# EasyEDA Pro project 1752201976896_ProPrj_orp传感器设计_2025-07-01.epro

# Schematic STM32最小系统
Board Name: Board1; Create Date: 2025-07-01; Page Name: P1; Project Name: orp传感器设计; Schematic Name: STM32最小系统; Update Date: 2025-07-01; Company: 嘉立创EDA; Page Size: A4; Version: V1.0
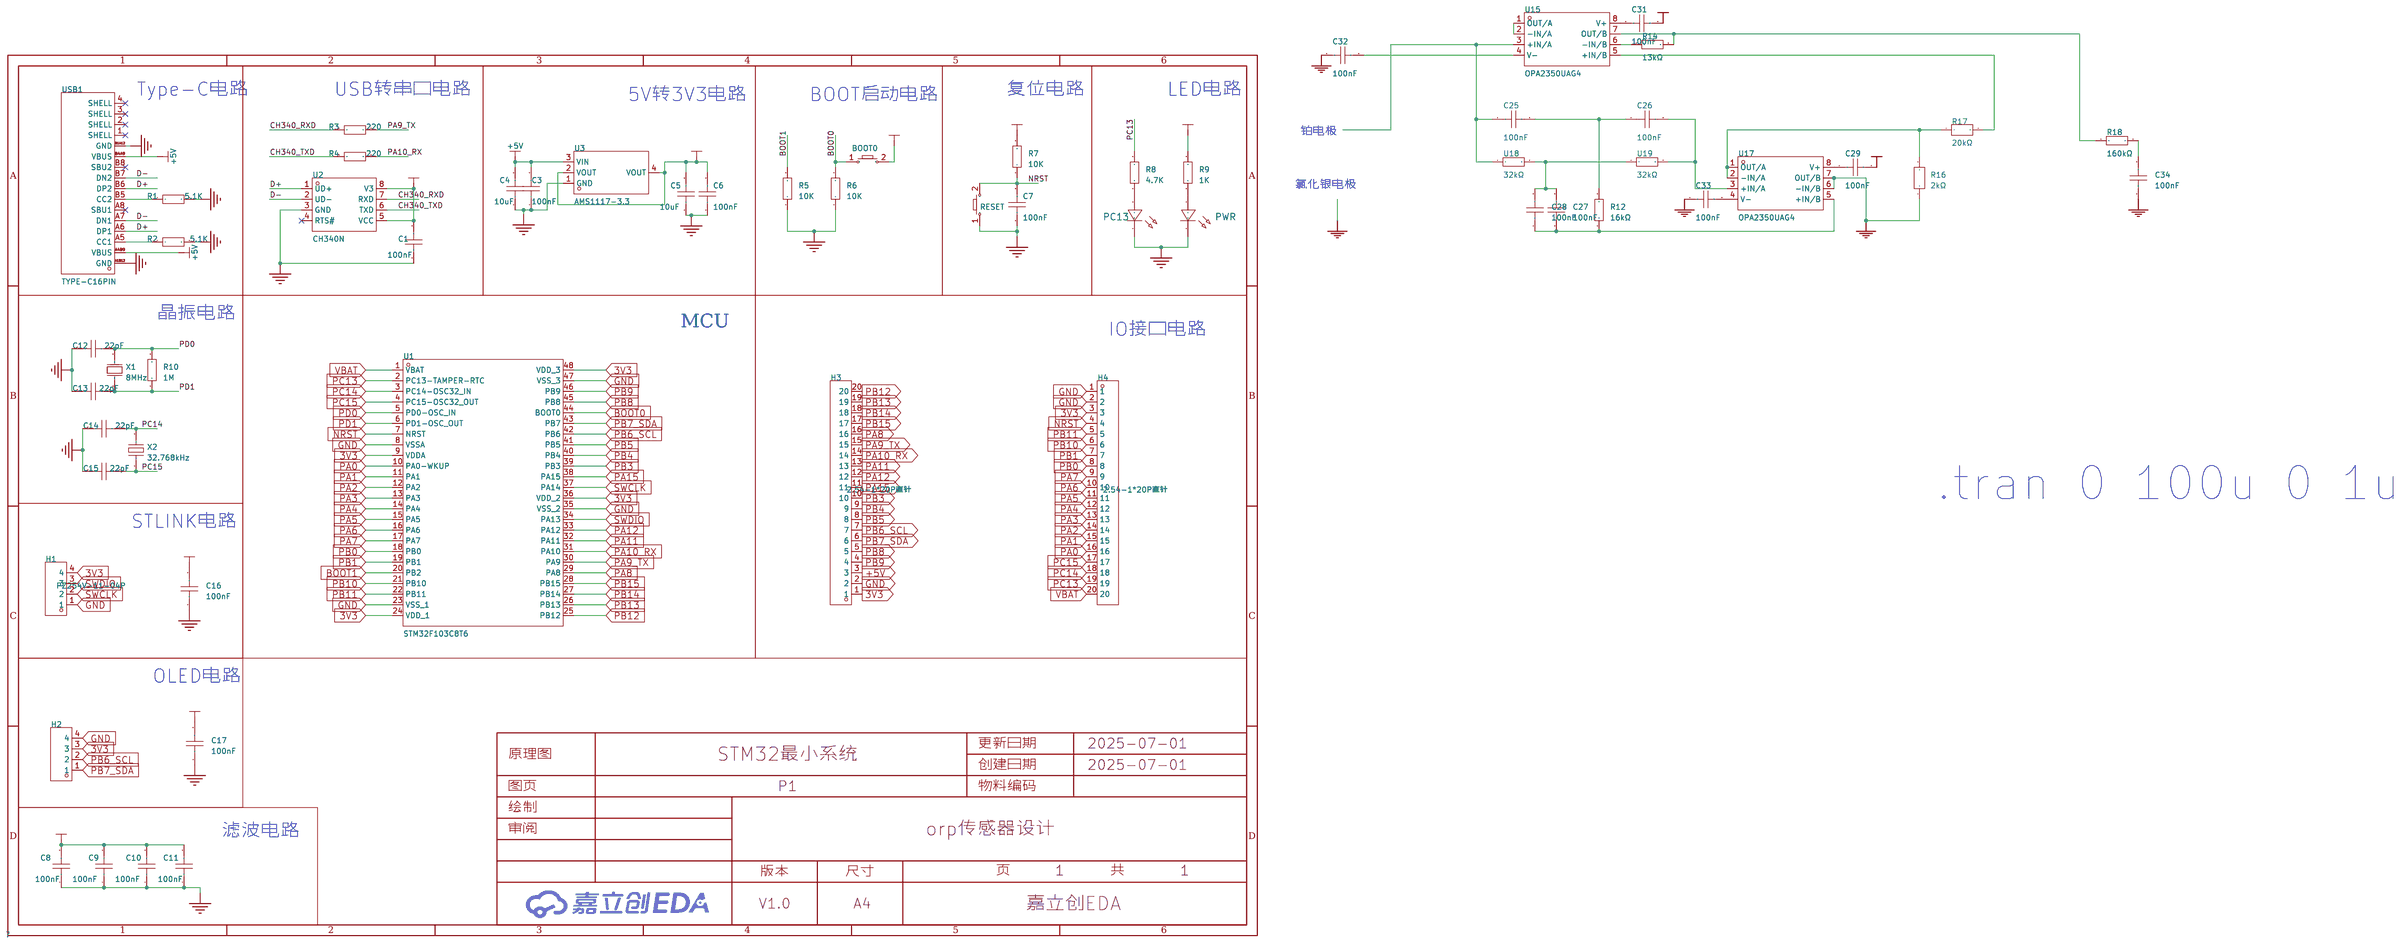
[diagram p0: schematic sheet]

## Parts
BOOT0  -  [Key_SMD_3x4x2]
C1  100nF  [C0603]
C3  100nF  [C0603]
C4  10uF  [C0603]
C5  10uF  [C0603]
C6  100nF  [C0603]
C7  100nF  [C0603]
C8  100nF  [C0603]
C9  100nF  [C0603]
C10  100nF  [C0603]
C11  100nF  [C0603]
C12  22pF  [C0603]
C13  22pF  [C0603]
C14  22pF  [C0603]
C15  22pF  [C0603]
C16  100nF  [C0603]
C17  100nF  [C0603]
C25  100nF  [CAP-TH_L5.5-W3.2-P5.00-D0.5]
C26  100nF  [CAP-TH_L5.5-W3.2-P5.00-D0.5]
C27  100nF  [CAP-TH_L5.5-W3.2-P5.00-D0.5]
C28  100nF  [CAP-TH_L5.5-W3.2-P5.00-D0.5]
C29  100nF  [CAP-TH_L5.5-W3.2-P5.00-D0.5]
C31  100nF  [CAP-TH_L5.5-W3.2-P5.00-D0.5]
C32  100nF  [CAP-TH_L5.5-W3.2-P5.00-D0.5]
C33  100nF  [CAP-TH_L5.5-W3.2-P5.00-D0.5]
C34  100nF  [CAP-TH_L5.5-W3.2-P5.00-D0.5]
H1  PZ254V-11-04P  [HDR-TH_4P-P2.54-V-M]
H2  -  [HDR-TH_4P-P2.54-V-F]
H3  2.54-1*20P直针  [HDR-TH_20P-P2.54-V-M-1]
H4  2.54-1*20P直针  [HDR-TH_20P-P2.54-V-M-1]
PC13  -  [LED_0603]
PWR  -  [LED_0603]
R1  5.1K  [R0603]
R2  5.1K  [R0603]
R3  220  [R0603]
R4  220  [R0603]
R5  10K  [R0603]
R6  10K  [R0603]
R7  10K  [R0603]
R8  4.7K  [R0603]
R9  1K  [R0603]
R10  1M  [R0603]
R12  16kΩ  [R0603]
R14  13kΩ  [R0603]
R16  2kΩ  [R0603]
R17  20kΩ  [R0603]
R18  160kΩ  [R0603]
RESET  -  [Key_SMD_3x4x2]
U1  STM32F103C8T6  [LQFP-48_L7.0-W7.0-P0.50-LS9.0-BL]
U2  CH340N  [SOP-8_L4.9-W3.9-P1.27-LS6.0-BL]
U3  AMS1117-3.3  [SOT-223-3_L6.5-W3.4-P2.30-LS7.0-BR]
U15  OPA2350UAG4  [SOIC-8_L4.9-W3.9-P1.27-LS6.0-BL]
U17  OPA2350UAG4  [SOIC-8_L4.9-W3.9-P1.27-LS6.0-BL]
U18  32kΩ  [RES-TH_BD2.4-L6.3-P10.30-D0.6]
U19  32kΩ  [RES-TH_BD2.4-L6.3-P10.30-D0.6]
USB1  TYPE-C16PIN  [USB-C-SMD_TYPE-C16PIN]
X1  8MHz  [CRYSTAL-SMD_L5.0-W3.2]
X2  32.768kHz  [OSC-SMD_L3.2-W1.5]

## Library data of the parts
BOOT0 RESET = Key_SMD_3x4x2: Supplier Footprint: SMD
C1 C3-C17 = CAP_0603: Supplier Footprint: 0603
C25-C29 C31-C34 = RDE5C1H104J2M1H03A: 容值:100nF;精度:±5%;额定电压:50V;温度系数:C0G;; LCSC Part Name: 100nF ±5% 50V; Supplier Part: C907942; Manufacturer: muRata(村田); Supplier Footprint: 插件,P=5mm; JLCPCB Part Class: 扩展库; Datasheet: https://atta.szlcsc.com/upload/public/pdf/source/20201103/C907942_74AC9C002598B47DA653AE5011BF73C6.pdf; Supplier: LCSC; Tolerance: ±5%; Voltage Rated: 50V; Temperature Coefficient: C0G
H1 = PZ254V-11-04P_C492403: 插针结构:1x4P;间距:2.54mm;行距:-;圆针/方针:方针;安装方式:直插;排数:单排;总PIN位数:4P;额定电流:-;额定电压:-;配合针长度:6mm;塑高:2.5mm;端接针长度:3mm;触头材质:黄铜;触头镀层:-;工作温度:-40℃~+105℃;颜色:黑色;; LCSC Part Name: 1x4P 间距:2.54mm 方针 直插; Supplier Part: C492403; Manufacturer: XFCN(兴飞); Supplier Footprint: 插件,P=2.54mm; JLCPCB Part Class: Extended Part; Datasheet: https://atta.szlcsc.com/upload/public/pdf/source/20200309/C492403_F9F19131791D08044AD4F84F8E751A34.pdf; Supplier: LCSC; Pin Structure: 1x4P; Pitch: 2.54mm; Circluar Pins/Square Pins: 方针; Mounting Type: 直插; Number of Rows: 单排; Number of Pins: 4P; Length of Mating Pin: 6mm; Insulation Height: 2.5mm; Length of End Connection Pin: 3mm; Contact Material: 黄铜; Operating Temperature: -40℃~+105℃; Color: 黑色
H2 = HDR-F_2.54_1x4P: Supplier Part: C2718488; Supplier Footprint: 插件
H3 H4 = 2.54-1*20P直针: 插针结构:1x20P;间距:2.54mm;行距:-;圆针/方针:方针;安装方式:直插;排数:单排;总PIN位数:20P;额定电流:3A;额定电压:-;配合针长度:-;塑高:-;端接针长度:-;触头材质:黄铜;触头镀层:-;工作温度:-40℃~+105℃;颜色:黑色;; LCSC Part Name: 1x20P 间距:2.54mm 方针 直插; Supplier Part: C50981; Manufacturer: BOOMELE(博穆精密); Supplier Footprint: 插件,P=2.54mm; JLCPCB Part Class: Extended Part; Datasheet: https://atta.szlcsc.com/upload/public/pdf/source/20151109/1457707572883.pdf; Supplier: LCSC; Pin Structure: 1x20P; Pitch: 2.54mm; Circluar Pins/Square Pins: 方针; Mounting Type: 直插; Number of Rows: 单排; Number of Pins: 20P; Current Rating: 3A; Contact Material: 黄铜; Operating Temperature: -40℃~+105℃; Color: 黑色
PC13 PWR = LED_0603-R: Supplier Footprint: 0603
R1-R10 = Res_0603: Supplier Footprint: 0603
R12 = RN73H1JTTD1602B25: 电阻类型:金属膜电阻;阻值:16kΩ;精度:±0.1%;功率:100mW;最大工作电压:75V;温度系数:±25ppm/℃;; LCSC Part Name: 金属膜电阻 16kΩ ±0.1% 100mW; Supplier Part: C186215; Manufacturer: KOA; Supplier Footprint: 0603; JLCPCB Part Class: 扩展库; Datasheet: https://atta.szlcsc.com/upload/public/pdf/source/20180504/C186301_C27E1BE5F8243F699B52B606AD6FD604.pdf; Supplier: LCSC; Type: 金属膜电阻; Tolerance: ±0.1%; Power(Watts): 100mW; Overload Voltage (Max): 75V; Temperature Coefficient: ±25ppm/℃; Operating Temperature Range: -55℃~+155℃
R14 = PTFR0603B13K0P9: 电阻类型:薄膜电阻;阻值:13kΩ;精度:±0.1%;功率:100mW;工作电压:100V;温度系数:±25ppm/℃;; LCSC Part Name: 薄膜电阻 13kΩ ±0.1% 100mW; Supplier Part: C351682; Manufacturer: RESI(开步睿思); Supplier Footprint: 0603; JLCPCB Part Class: 扩展库; Datasheet: https://atta.szlcsc.com/upload/public/pdf/source/20240506/11BDC7478D84177AC2A5326A65B6EB29.pdf; Supplier: LCSC; Type: 薄膜电阻; Tolerance: ±0.1%; Power(Watts): 100mW; Voltage-Supply(Max): 100V; Temperature Coefficient: ±25ppm/℃; Operating Temperature: -55℃~+125℃
R16 = RT0603BRD072KL: 电阻类型:薄膜电阻;阻值:2kΩ;精度:±0.1%;功率:100mW;温度系数:±25ppm/℃;; LCSC Part Name: 薄膜电阻 2kΩ ±0.1% 100mW; Supplier Part: C728588; Manufacturer: YAGEO(国巨); Supplier Footprint: 0603; JLCPCB Part Class: 扩展库; Datasheet: https://atta.szlcsc.com/upload/public/pdf/source/20200814/C723483_9C38DBFE9BAEFED0FBB9716EAA9FF07C.pdf; Supplier: LCSC; Type: 薄膜电阻; Tolerance: ±0.1%; Power(Watts): 100mW; Temperature Coefficient: ±25ppm/℃; Operating Temperature Range: -55℃~+155℃
R17 = RT0603BRD0720KL: 电阻类型:薄膜电阻;阻值:20kΩ;精度:±0.1%;功率:100mW;最大工作电压:75V;温度系数:±25ppm/℃;; LCSC Part Name: 薄膜电阻 20kΩ ±0.1% 100mW; Supplier Part: C723637; Manufacturer: YAGEO(国巨); Supplier Footprint: 0603; JLCPCB Part Class: 扩展库; Datasheet: https://atta.szlcsc.com/upload/public/pdf/source/20200814/C723637_57E5E8B3C02F5D5BA42E401EB3E82C8B.pdf; Supplier: LCSC; Type: 薄膜电阻; Tolerance: ±0.1%; Power(Watts): 100mW; Overload Voltage (Max): 75V; Temperature Coefficient: ±25ppm/℃; Operating Temperature Range: -55℃~+155℃
R18 = RC0603FR-07160KL: 电阻类型:厚膜电阻;阻值:160kΩ;精度:±1%;功率:100mW;最大工作电压:75V;温度系数:±100ppm/℃;; LCSC Part Name: 厚膜电阻 160kΩ ±1% 100mW; Supplier Part: C137793; Manufacturer: YAGEO(国巨); Supplier Footprint: 0603; JLCPCB Part Class: 扩展库; Datasheet: https://atta.szlcsc.com/upload/public/pdf/source/20180821/C275644_0D56F95EFF785E7D9A1FEF436B37DA78.pdf; Supplier: LCSC; Type: 厚膜电阻; Tolerance: ±1%; Power(Watts): 100mW; Overload Voltage (Max): 75V; Temperature Coefficient: ±100ppm/℃; Operating Temperature Range: -55℃~+155℃
U1 = STM32F103C8T6: CPU内核:ARM-M3;程序存储容量:64KB;RAM总容量:20KB;GPIO端口数量:37;工作电压范围:2V~3.6V;CPU最大主频:72MHz;程序存储器类型:FLASH;; Supplier Part: C8734; Manufacturer: ST(意法半导体); Supplier Footprint: LQFP-48(7x7); JLCPCB Part Class: 扩展库; Datasheet: https://atta.szlcsc.com/upload/public/pdf/source/20220812/8363ACEC51AD55ECEB84799464F7CB85.pdf; Supplier: LCSC; CPU Core: ARM-M3; Program Storage Size: 64KB; RAM Size: 20KB; GPIO Ports Number: 37; Operating Voltage Range: 2V~3.6V; CPU Maximum Speed: 72MHz; Program Memory Type: FLASH; Operating Temperature Range: -40℃~+85℃; ADC (Bit): 12bit; Universal Serial Bus: 有; Peripheral/Function: 看门狗；DMA；看门狗；温度传感器; Watchdog: 有; Infrared Data Association: 有; Low-Voltage Detect: 有; Direct Memory Access: 有; Internal Oscillator: 有
U2 = CH340N: LCSC Part Name: USB转串口芯片 CH340; Supplier Part: C2977777; Manufacturer: WCH(南京沁恒); Supplier Footprint: SOP-8; JLCPCB Part Class: 扩展库; Datasheet: https://atta.szlcsc.com/upload/public/pdf/source/20230530/6E401E9554E9F5311886CC8B3F89B62E.pdf; Supplier: LCSC
U3 = AMS1117-3.3_C6186: 输出类型:固定;最大输入电压:-;输出电压:3.3V;最大输出电流:1A;电源纹波抑制比(PSRR):72dB@(120Hz);输出极性:正极;; LCSC Part Name: 输出3.3V 1A; Supplier Part: C6186; Manufacturer: AMS; Supplier Footprint: SOT-223; Datasheet: https://atta.szlcsc.com/upload/public/pdf/source/20180727/C6186_7A095716F0823C02F1997A905E26C086.pdf; Supplier: LCSC; Output Type: 固定; Output Voltage: 3.3V; MAX Output Current: 1A; Power Supply Rejection Ratio (PSRR): 72dB@(120Hz); Dropout Voltage: 1.3V@(800mA); Output Polarity: 正极; Number of Outputs: 1
U15 U17 = OPA2350UAG4: 双路单电源、轨到轨、高速、低噪声运算放大器 8-SOIC -40 to 85; Supplier Part: C1348173; Manufacturer: TI(德州仪器); Supplier Footprint: SOIC-8; JLCPCB Part Class: 扩展库; Datasheet: https://www.ti.com/cn/lit/gpn/opa2350; Supplier: LCSC
U18 U19 = MFR50SDRD52-32K: 电阻类型:金属膜电阻;阻值:32kΩ;精度:±0.5%;功率:500mW;温度系数:±25ppm/℃;; LCSC Part Name: 金属膜电阻 32kΩ ±0.5% 500mW; Supplier Part: C1753019; Manufacturer: YAGEO(国巨); Supplier Footprint: 插件,D2.4xL6.3mm; JLCPCB Part Class: 扩展库; Datasheet: https://atta.szlcsc.com/upload/public/pdf/source/20201029/C911418_CEA09B7112BCFF5AE38F343DDB8D42E7.pdf; Supplier: LCSC; Type: 金属膜电阻; Tolerance: ±0.5%; Power(Watts): 500mW; Temperature Coefficient: ±25ppm/℃; Operating Temperature Range: -55℃~+155℃
USB1 = TYPE-C16PIN: 连接器类型:Type-C;标准:-;公母:母;端口数量:1;触点数量:16P;安装方式:卧贴;额定电流 - 电源:3A;工作温度范围:-40℃~+85℃;; LCSC Part Name: Type-C 母 卧贴; Supplier Part: C393939; Manufacturer: SHOU HAN(首韩); Supplier Footprint: SMD; JLCPCB Part Class: 扩展库; Datasheet: https://atta.szlcsc.com/upload/public/pdf/source/20190521/C393939_7B9043D4CF1026AF443AB60D91FBCD5C.pdf; Supplier: LCSC; Connector Type: Type-C; Gender: 母; Number of Ports: 1; Number of Contacts: 16P; Mounting Style: 卧贴; Current Rating - Power (Max): 3A; Operating Temperature Range: -40℃~+85℃
X1 = X50328MSB2GI: 晶振类型:贴片晶振;频率:8MHz;常温频差:±10ppm;外接负载电容:20pF;频率稳定度(全温):±20ppm;; LCSC Part Name: 8MHz ±10ppm 20pF YSX530GA; Supplier Part: C115962; Manufacturer: YXC(扬兴晶振); Supplier Footprint: SMD5032; JLCPCB Part Class: 基础库; Datasheet: https://atta.szlcsc.com/upload/public/pdf/source/20240329/44922B0AF7B60E58E9B66993B6077277.pdf; Supplier: LCSC; Crystal Type: 贴片晶振; Normal temperature Frequency Tolerance: ±10ppm; External load capacitor: 20pF; Frequency Stability(Full temperature range): ±20ppm; Operating Temperature: -40℃~+85℃
X2 = X321532768KGD2SI: 晶振类型:贴片晶振;频率:32.768kHz;常温频差:±20ppm;外接负载电容:12.5pF;频率稳定度(全温):-;; LCSC Part Name: 32.768kHz ±20ppm 12.5pF; Supplier Part: C620155; Manufacturer: YXC(扬兴晶振); Supplier Footprint: SMD3215-2P; JLCPCB Part Class: 扩展库; Datasheet: https://atta.szlcsc.com/upload/public/pdf/source/20240329/3A7650FD985DD0DE85694D3785AB4916.pdf; Supplier: LCSC; Crystal Type: 贴片晶振; Normal temperature Frequency Tolerance: ±20ppm; External load capacitor: 12.5pF; Operating Temperature: -40℃~+85℃

## Nets
3V3: BOOT0.2 C1.2 C5.2 C6.2 C8.2 C9.2 C10.2 C11.2 C16.2 C17.2 C29.2 C31.2 H1.4 H2.3 H3.1 H4.3 R7.2 R9.2 U1.9(VDDA) U1.24(VDD_1) U1.36(VDD_2) U1.48(VDD_3) U2.5(VCC) U2.8(V3) U3.2(VOUT) U3.4(VOUT)
+5V: C3.2 C4.2 H3.3 U3.3(VIN) USB1.A4B9(VBUS) USB1.B4A9(VBUS)
GND: C1.1 C3.1 C4.1 C5.1 C6.1 C7.1 C8.1 C9.1 C10.1 C11.1 C12.1 C13.1 C14.1 C15.1 C16.1 C17.1 C32.1 C33.1 C34.1 H1.1 H2.4 H3.2 H4.1 H4.2 PC13.1(C) PWR.1(C) R1.2 R2.2 R5.1 R6.1 R16.1 RESET.1 U1.8(VSSA) U1.23(VSS_1) U1.35(VSS_2) U1.47(VSS_3) U2.3(GND) U3.1(GND) U17.6(-IN/B) U17.7(OUT/B) USB1.A1B12(GND) USB1.B1A12(GND)
VBAT: H4.20 U1.1(VBAT)
BOOT0: BOOT0.1 R6.2 U1.44(BOOT0)
BOOT1: R5.2 U1.20(PB2)
CH340_RXD: R3.1 U2.7(RXD)
CH340_TXD: R4.1 U2.6(TXD)
D+: U2.1(UD+) USB1.A6(DP1) USB1.B6(DP2)
D-: U2.2(UD-) USB1.A7(DN1) USB1.B7(DN2)
NRST: C7.2 H4.4 R7.1 RESET.2 U1.7(NRST)
PA0: H4.16 U1.10(PA0-WKUP)
PA1: H4.15 U1.11(PA1)
PA2: H4.14 U1.12(PA2)
PA3: H4.13 U1.13(PA3)
PA4: H4.12 U1.14(PA4)
PA5: H4.11 U1.15(PA5)
PA6: H4.10 U1.16(PA6)
PA7: H4.9 U1.17(PA7)
PA8: H3.16 U1.29(PA8)
PA9_TX: H3.15 R3.2 U1.30(PA9)
PA10_RX: H3.14 R4.2 U1.31(PA10)
PA11: H3.13 U1.32(PA11)
PA12: H3.12 U1.33(PA12)
PA15: H3.11 U1.38(PA15)
PB0: H4.8 U1.18(PB0)
PB1: H4.7 U1.19(PB1)
PB3: H3.10 U1.39(PB3)
PB4: H3.9 U1.40(PB4)
PB5: H3.8 U1.41(PB5)
PB6_SCL: H2.2 H3.7 U1.42(PB6)
PB7_SDA: H2.1 H3.6 U1.43(PB7)
PB8: H3.5 U1.45(PB8)
PB9: H3.4 U1.46(PB9)
PB10: H4.6 U1.21(PB10)
PB11: H4.5 U1.22(PB11)
PB12: H3.20 U1.25(PB12)
PB13: H3.19 U1.26(PB13)
PB14: H3.18 U1.27(PB14)
PB15: H3.17 U1.28(PB15)
PC13: H4.19 R8.2 U1.2(PC13-TAMPER-RTC)
PC14: C14.2 H4.18 U1.3(PC14-OSC32_IN) X2.2
PC15: C15.2 H4.17 U1.4(PC15-OSC32_OUT) X2.1
PD0: C12.2 R10.2 U1.5(PD0-OSC_IN) X1.2(OSC2)
PD1: C13.2 R10.1 U1.6(PD1-OSC_OUT) X1.1(OSC1)
SWCLK: H1.2 U1.37(PA14)
SWDIO: H1.3 U1.34(PA13)
$1N712: R1.1 USB1.B5(CC2)
$1N738: R2.1 USB1.A5(CC1)
$1N2179: PC13.2(A) R8.1
$1N2206: PWR.2(A) R9.1
$1N9765: C25.2 C26.1 R12.2
$1N9766: C27.2 C28.2 U18.2 U19.1
$1N9767: C27.1 C28.1 R12.1 U17.5(+IN/B)
$1N9768: C26.2 U17.3(+IN/A) U19.2
$1N9771: R17.2 U15.5(+IN/B)
$1N9774: R14.2 R18.1 U15.7(OUT/B)
$1N9778: C34.2 R18.2
$1N9779: C25.1 U15.3(+IN/A) U18.1
$1N9980: C32.2 U15.4(V-)
$1N9986: U15.1(OUT/A) U15.2(-IN/A)
$1N10082: R14.1 U15.6(-IN/B)
$1N10207: R16.2 R17.1 U17.1(OUT/A) U17.2(-IN/A)
$1N10725: C29.1 U17.8(V+)
$1N10730: C31.1 U15.8(V+)
$1N10772: C33.2 U17.4(V-)

Not connected (* = marked no-connect by the designer): U2 4(RTS#)*; USB1 1(SHELL)* 2(SHELL)* 3(SHELL)* 4(SHELL)* A8(SBU1)* B8(SBU2)*

## Notes on the sheet
- Type-C电路
- USB转串口电路
- 5V转3V3电路
- BOOT启动电路
- 复位电路
- LED电路
- 铂电极
- 氯化银电极
- 晶振电路
- MCU
- IO接口电路
- .tran 0 100u 0 1u
- STLINK电路
- OLED电路
- 滤波电路

# Schematic orp传感器变送器
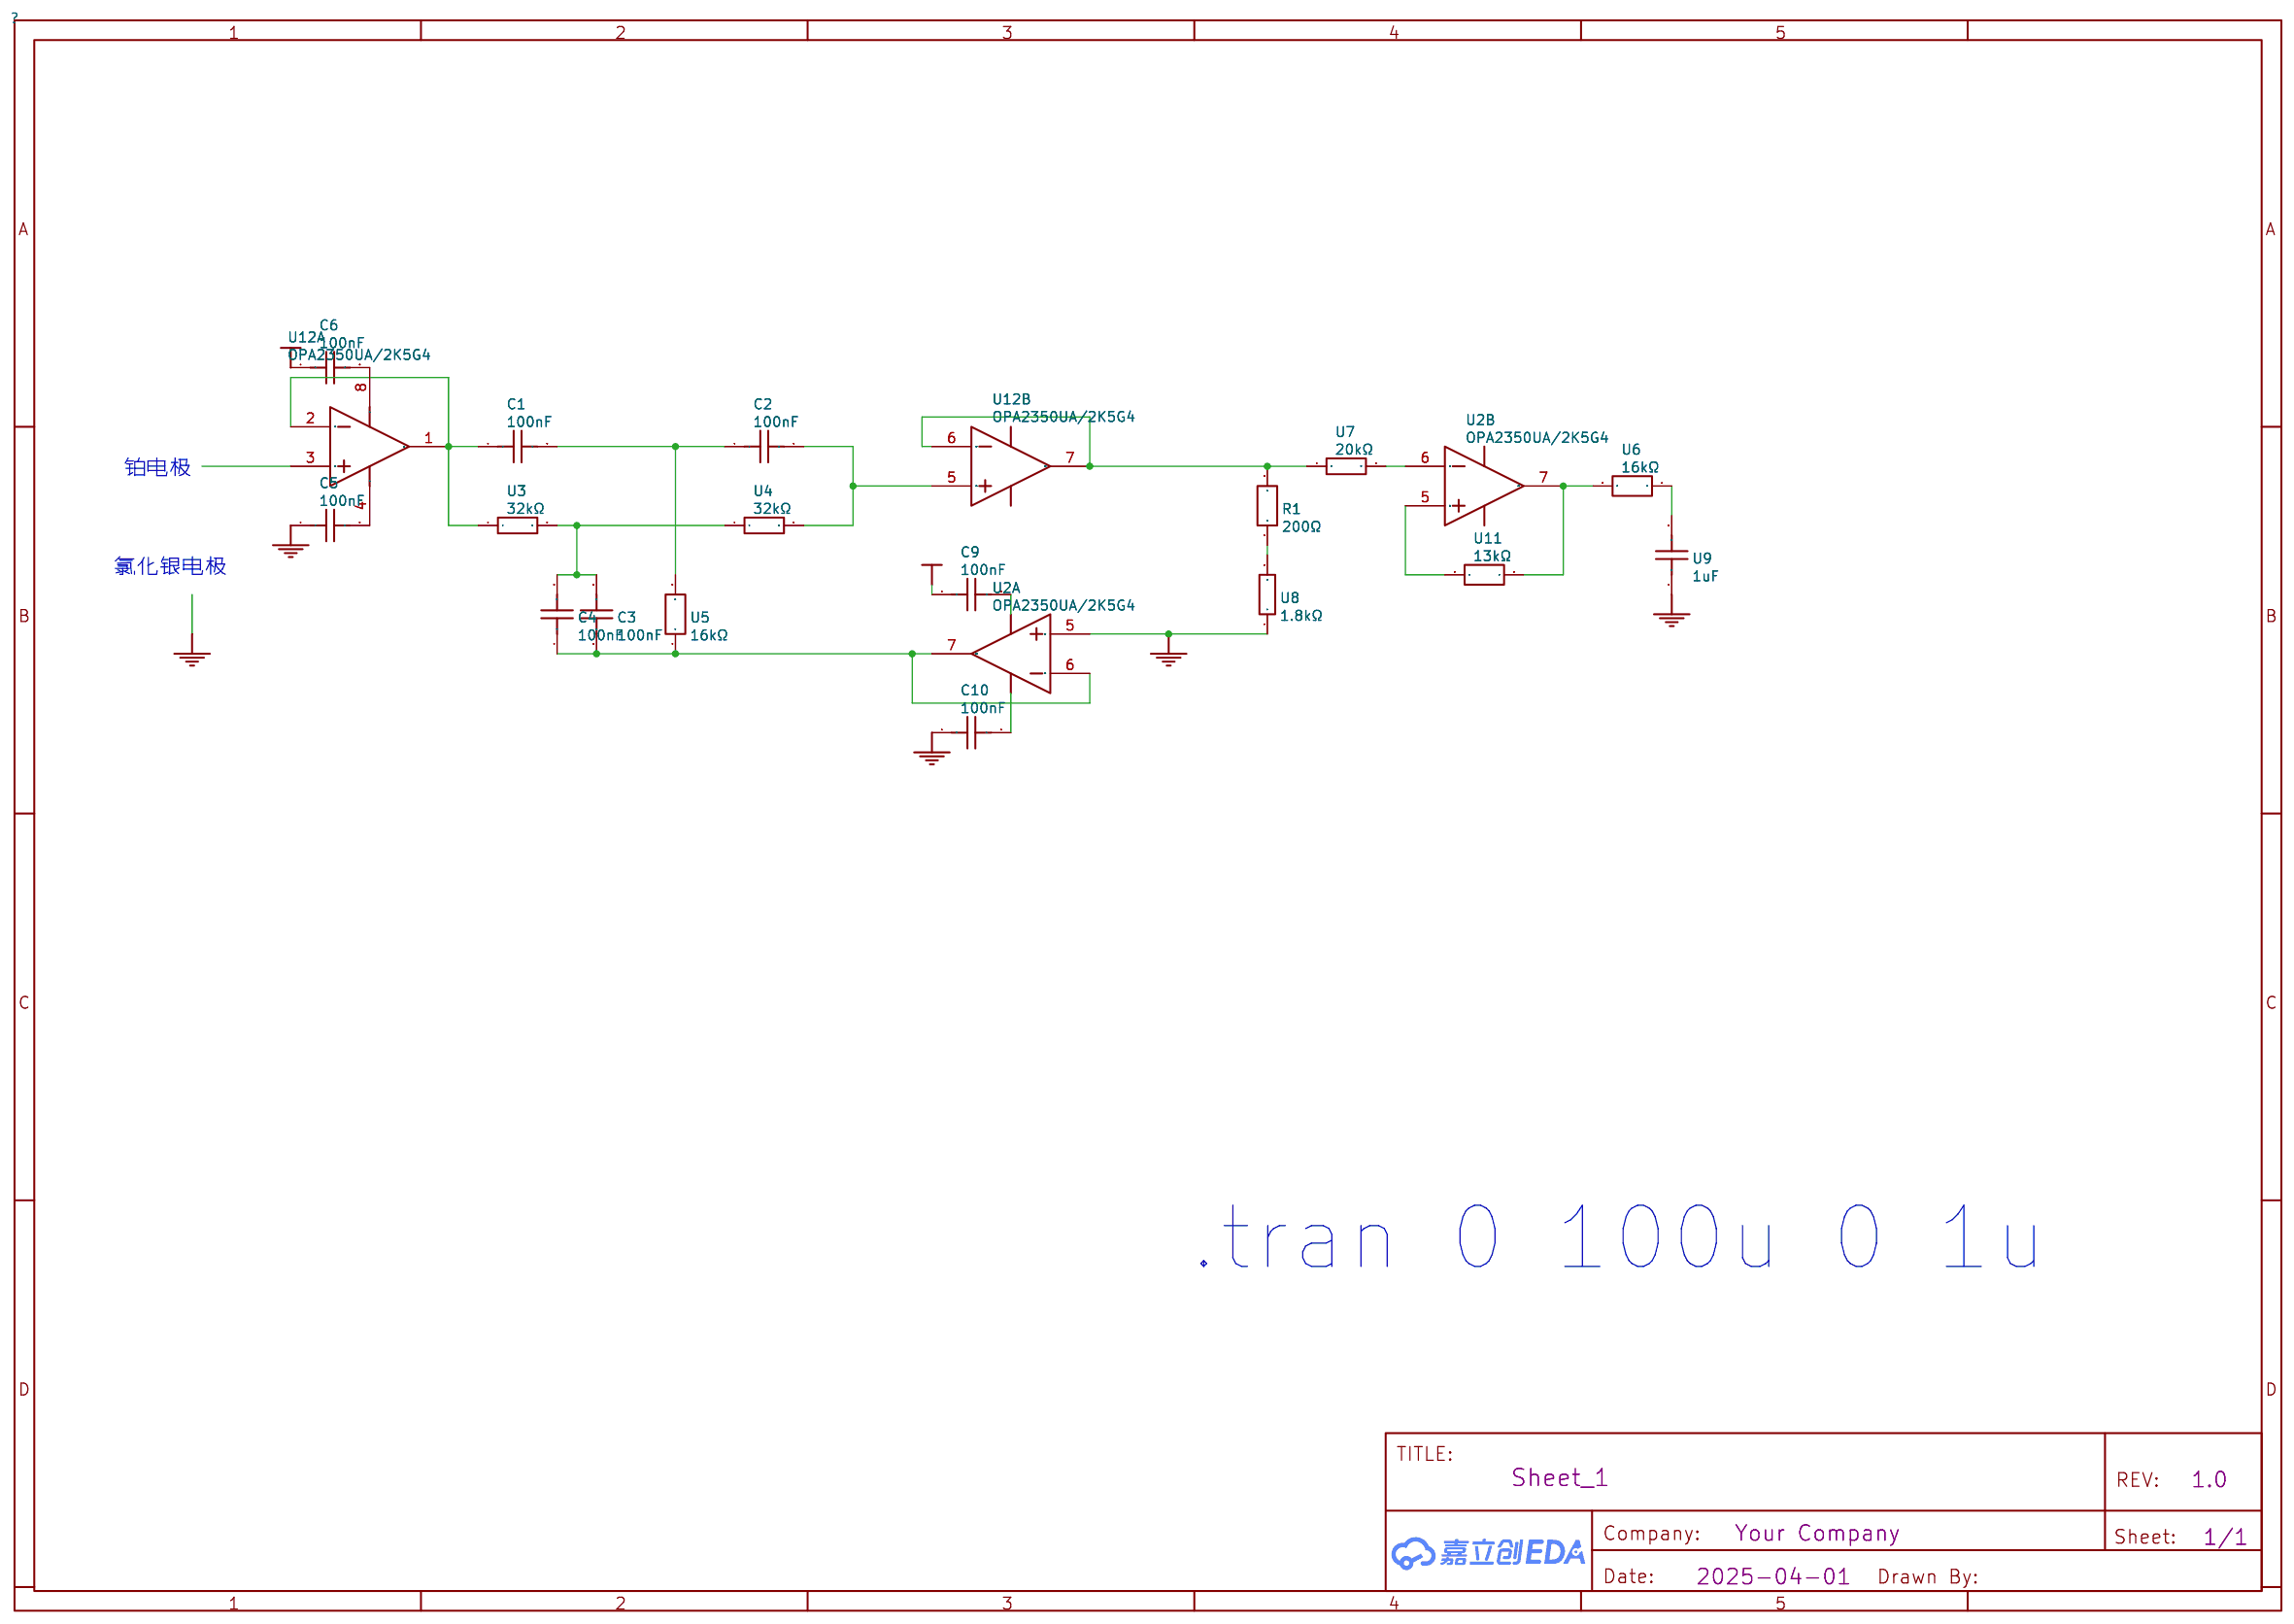
[diagram p1: schematic sheet]

## Parts
C1  100nF
C2  100nF
C3  100nF
C4  100nF
C5  100nF
C6  100nF
C9  100nF
C10  100nF
R1  200Ω
U2  OPA2350UA/2K5G4  (sections 1,2)
U3  32kΩ
U4  32kΩ
U5  16kΩ
U6  16kΩ
U7  20kΩ
U8  1.8kΩ
U9  1uF
U11  13kΩ
U12  OPA2350UA/2K5G4  (sections 1,2)

## Library data of the parts
C1-C4 = 100nF: Supplier: LCSC; Supplier Part: C3860120; Manufacturer: TDK; Manufacturer Part: CGJ5L2C0G1H104J160AA; JLCPCB Part Class: Extended Part; Contributor: lcsc; nameAlias: Value; spicePre: C; spiceSymbolName: CGJ5L2C0G1H104J160AA
C5 C6 C9 C10 = 100nF: Supplier: LCSC; Supplier Part: C3851823; Manufacturer: TDK; Manufacturer Part: C0603X7S1A104M030BC; JLCPCB Part Class: Extended Part; Contributor: lcsc; nameAlias: Value; spicePre: C; spiceSymbolName: C0603X7S1A104M030BC
R1 = 200Ω: Supplier: LCSC; Supplier Part: C1742789; Manufacturer: YAGEO(国巨); Manufacturer Part: FCR-25JR-52-200R; JLCPCB Part Class: Extended Part; Contributor: lcsc; nameAlias: Value; spicePre: R; spiceSymbolName: FCR-25JR-52-200R
U2 U12 = OPA2350UA/2K5G4: Supplier: LCSC; Supplier Part: C2059575; Manufacturer: TI(德州仪器); JLCPCB Part Class: Extended Part; subpart_no: 1; spicePre: U
U3 U4 = 32kΩ: Supplier: LCSC; Supplier Part: C1753019; Manufacturer: YAGEO(国巨); Manufacturer Part: MFR50SDRD52-32K; JLCPCB Part Class: Extended Part; Contributor: lcsc; nameAlias: Value; spicePre: U; spiceSymbolName: MFR50SDRD52-32K
U5 U6 = 16kΩ: Supplier: LCSC; Supplier Part: C1756541; Manufacturer: YAGEO(国巨); Manufacturer Part: FMP200FRE52-16K; JLCPCB Part Class: Extended Part; Contributor: lcsc; nameAlias: Value; spicePre: U; spiceSymbolName: FMP200FRE52-16K
U7 = 20kΩ: Supplier: LCSC; Supplier Part: C1745469; Manufacturer: YAGEO(国巨); Manufacturer Part: MF0204FRE52-20K; JLCPCB Part Class: Extended Part; Contributor: lcsc; nameAlias: Value; spicePre: U; spiceSymbolName: MF0204FRE52-20K
U8 = 1.8kΩ: Supplier: LCSC; Supplier Part: C1743064; Manufacturer: YAGEO(国巨); Manufacturer Part: MFR-12FRF52-1K8; JLCPCB Part Class: Extended Part; Contributor: lcsc; nameAlias: Value; spicePre: U; spiceSymbolName: MFR-12FRF52-1K8
U9 = 1uF: Supplier: LCSC; Supplier Part: C3875033; Manufacturer: TDK; Manufacturer Part: CGA4J2X5R1E105K125AA; JLCPCB Part Class: Extended Part; Contributor: lcsc; nameAlias: Value; spicePre: U; spiceSymbolName: CGA4J2X5R1E105K125AA
U11 = 13kΩ: Supplier: LCSC; Supplier Part: C1759134; Manufacturer: YAGEO(国巨); Manufacturer Part: HHV-25JR-52-13K; JLCPCB Part Class: Extended Part; Contributor: lcsc; nameAlias: Value; spicePre: U; spiceSymbolName: HHV-25JR-52-13K

## Nets
3.3V: C6.1 C9.1
GND: C5.1 C10.1 U2.5(INB+) U8.1 U9.1 U11.1
Net-(C1-1): C1.1 U3.1 U12.1(OUTA) U12.2(INA-)
Net-(C1-2): C1.2 C2.1 U5.2
Net-(C2-2): C2.2 U4.2 U12.5(INB+)
Net-(C3-1): C3.1 C4.1 U2.6(INB-) U2.7(OUTB) U5.1 U6.2 U7.2 U11.2
Net-(C3-2): C3.2 C4.2 U3.2 U4.1
Net-(C5-2): C5.2 U12.4(V-)
Net-(C6-2): C6.2 U12.8(V+)
Net-(R1-1): R1.1 U8.2
Net-(R1-2): R1.2 U7.1 U12.6(INB-) U12.7(OUTB)
Net-(U6-1): U6.1 U9.2

Not connected (* = marked no-connect by the designer): C9 2; C10 2; U12 3(INA+)

## Notes on the sheet
- 铂电极
- 氯化银电极
- .tran 0 100u 0 1u

# Board PCB1
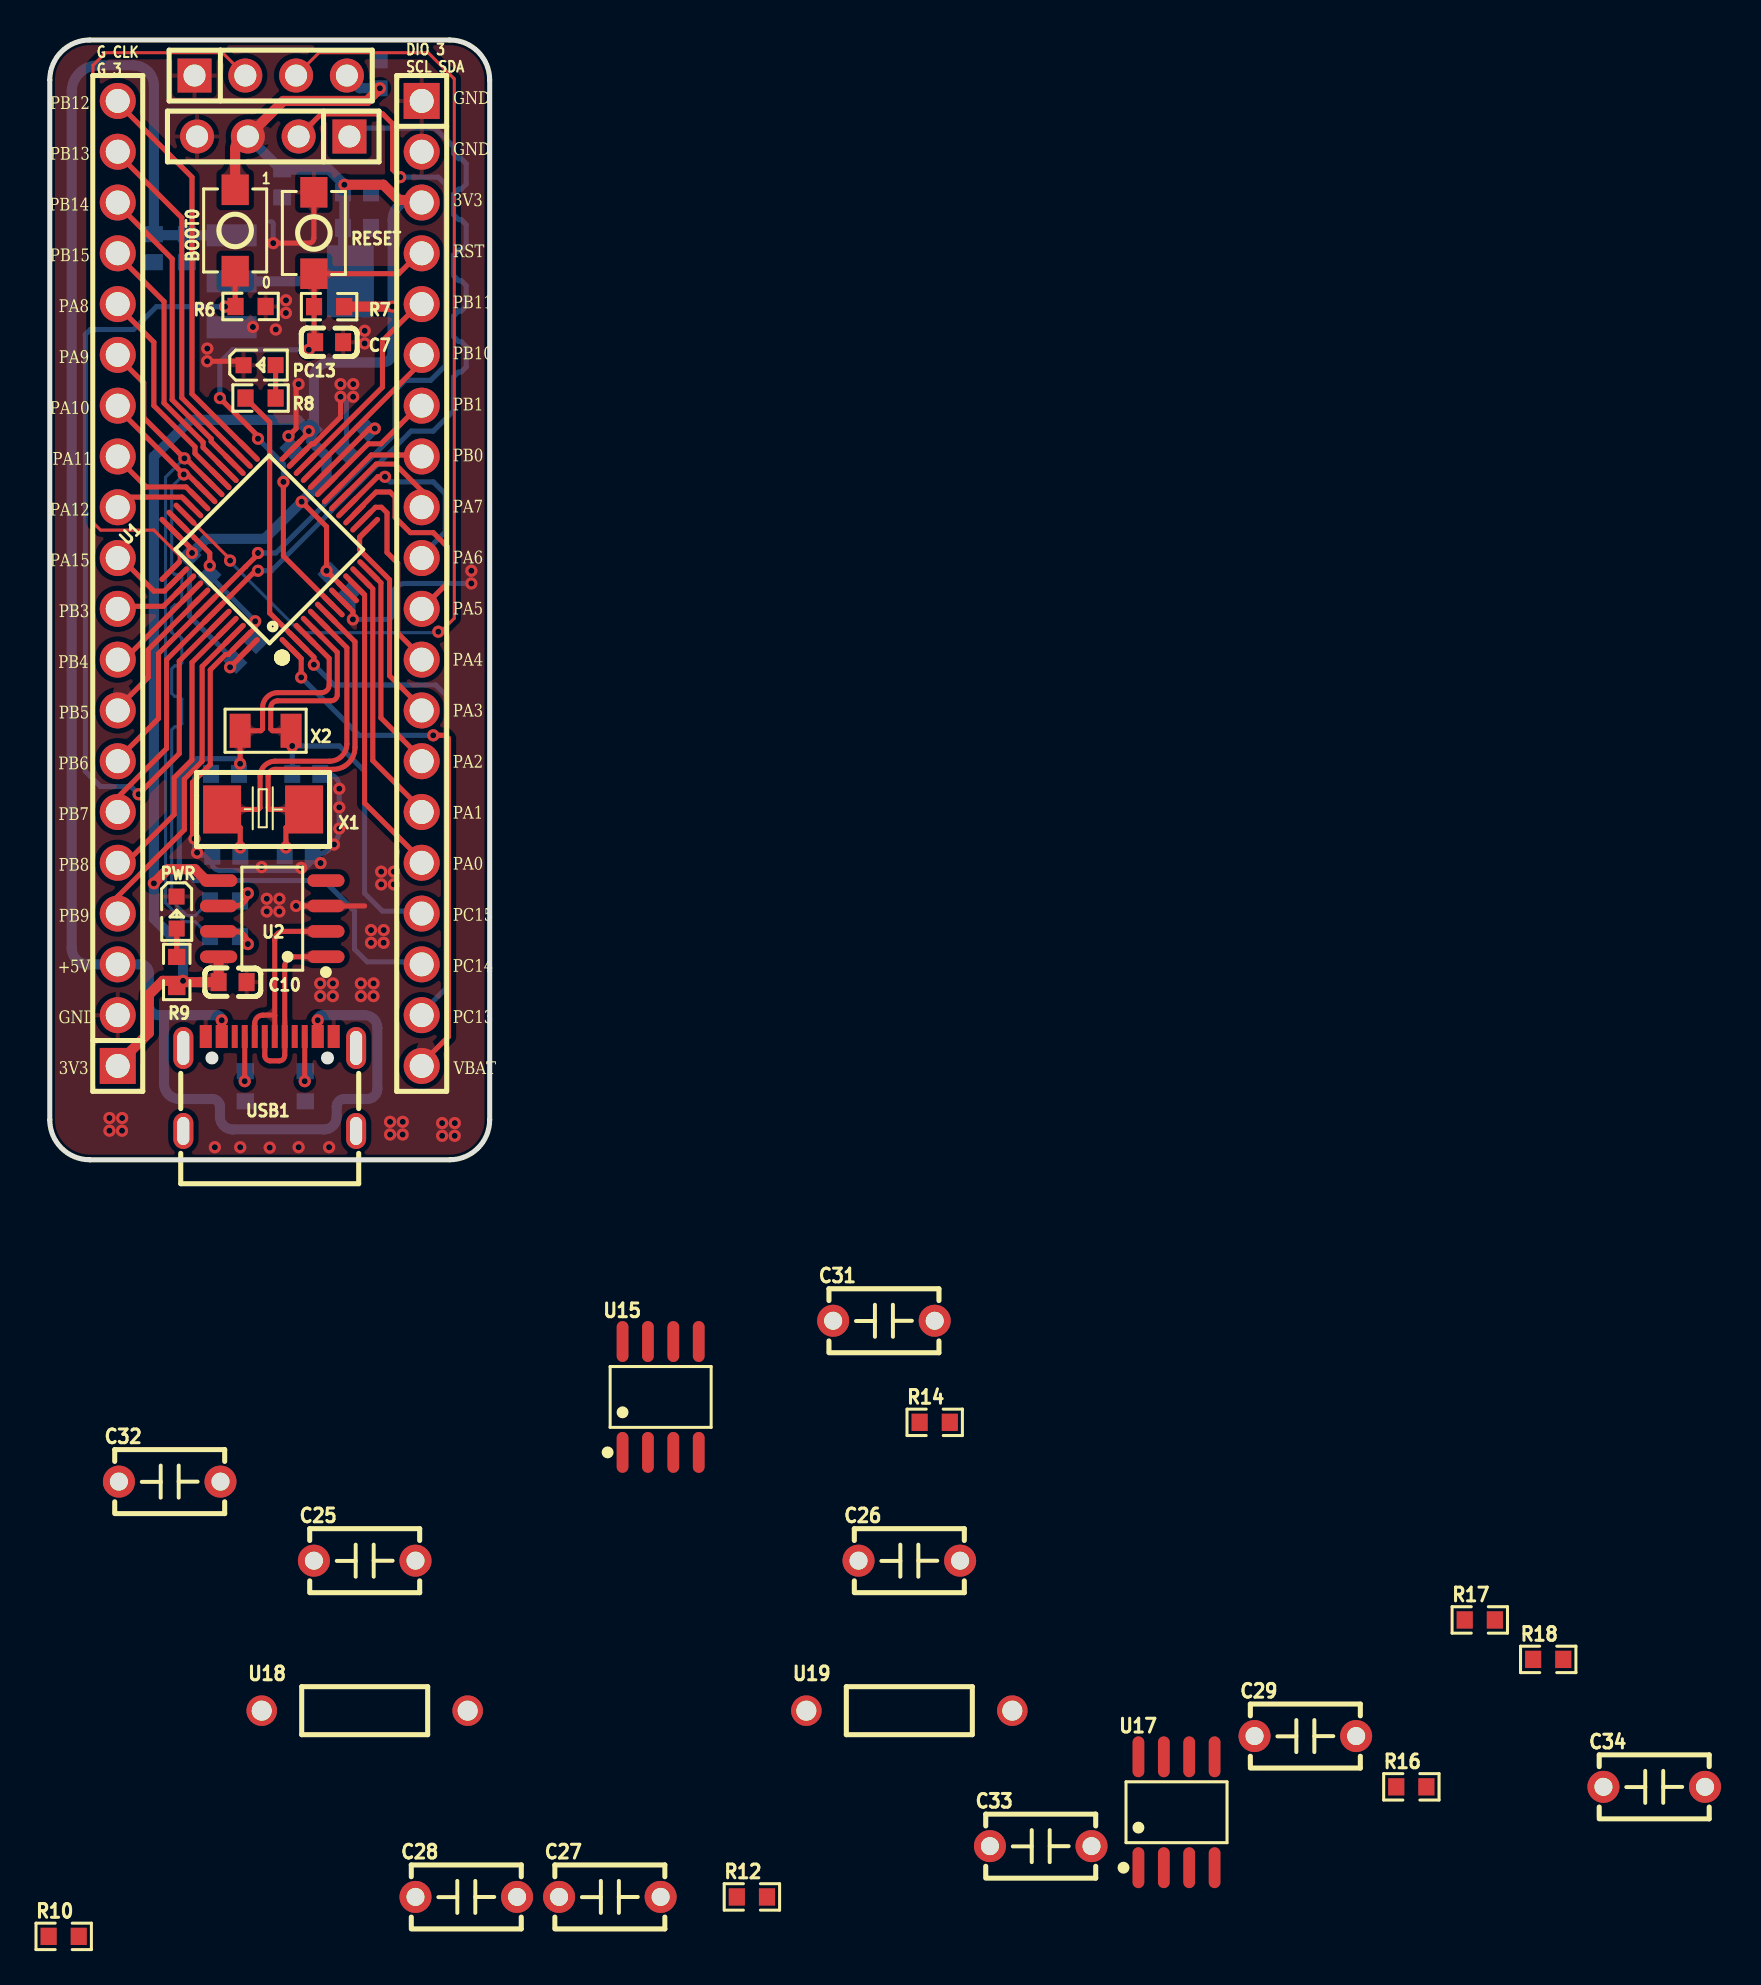
[diagram p2: board, top side]
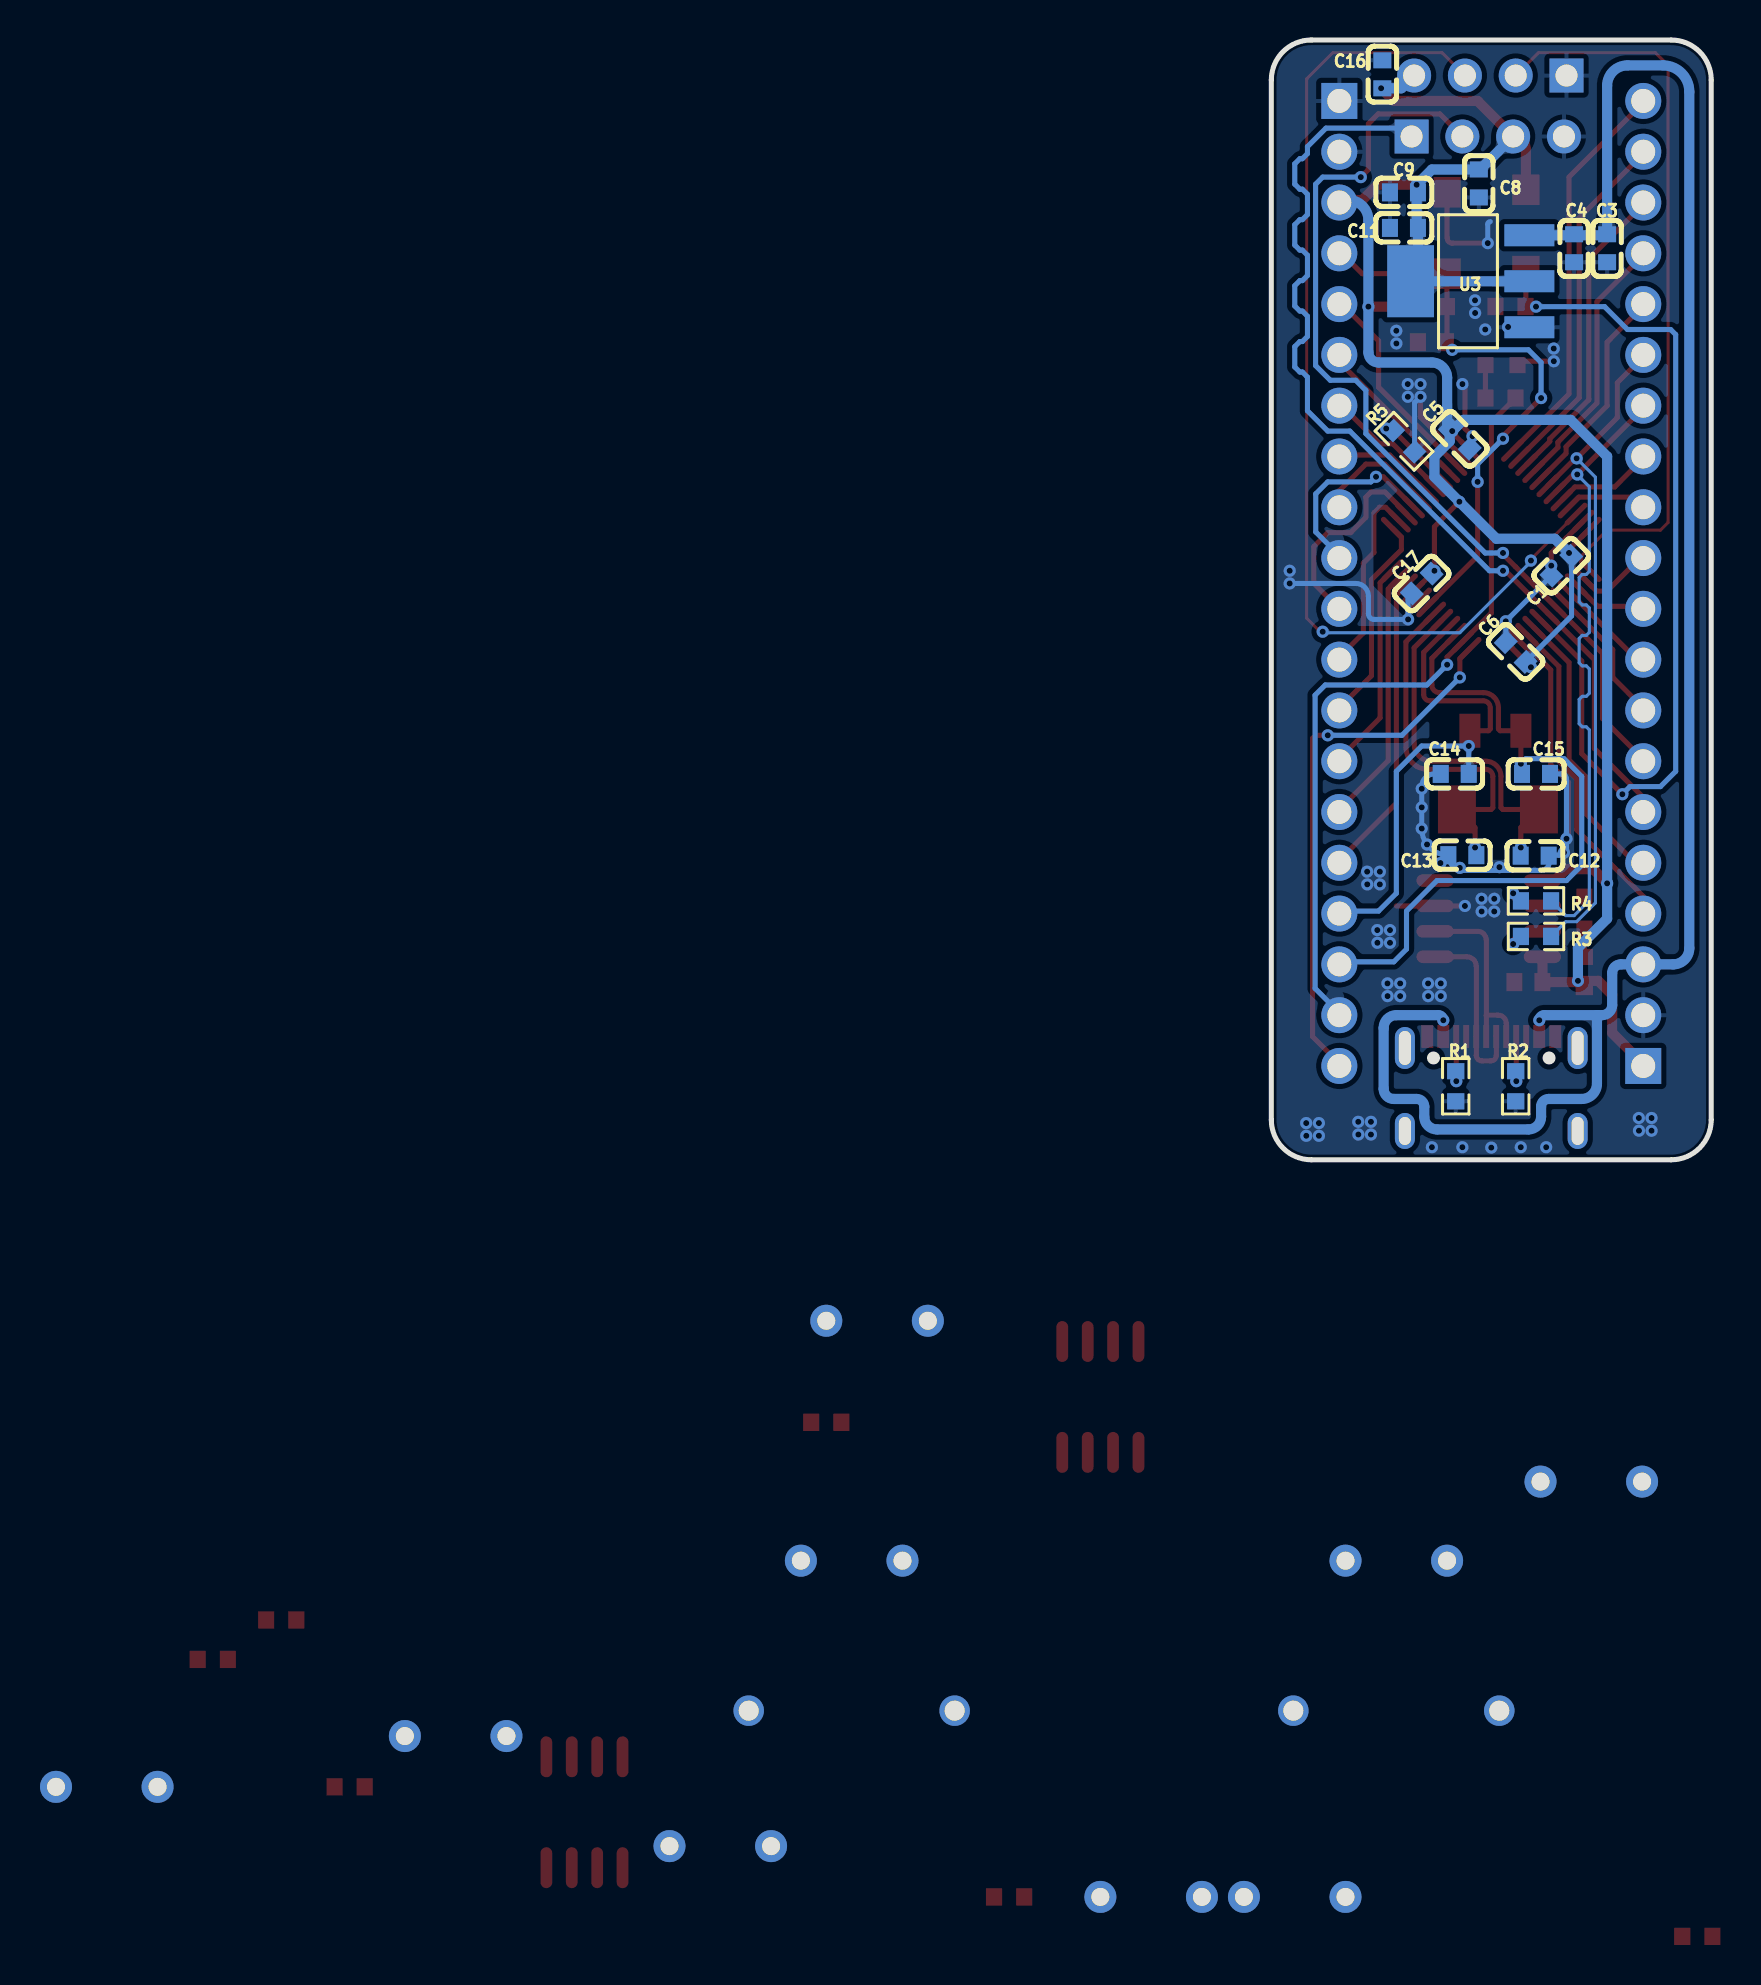
[diagram p3: board, bottom side, seen from below]

Outline 22 x 56 mm; copper layers: Top Layer, Bottom Layer. Coordinates in mm from the lower left corner of the outline.
Outline path: 0,54 0,2 arc(0.59,0.59) 2,0 20,0 arc(21.41,0.59) 22,2 22,54 arc(21.41,55.41) 20,56 2,56 arc(0.59,55.41) 0,54
Stack: Top Layer 0.035mm / Dielectric1 1.51mm FR4 er 4.5 / Bottom Layer 0.035mm

## Design rules (mm)
template: 自定义配置
spacing copperThickness1oz (default): track to track 0.152, other pairs 0.152 to 0.3
spacing copperThickness2oz: track to track 0.203, other pairs 0.152 to 0.3
track width copperThickness1oz (default): min 0.127, default 0.254, max 2.54
track width copperThickness2oz: min 0.203, default 0.254, max 2.54
differential pair differentialPair (default): width min 0.127, default 0.254, max 2.54; gap min 0.152, default 0.152
via viaSize (default): diameter min 0.5, default 0.61, max 10; hole min 0.3, default 0.305, max 6.299

## Placement (name value [footprint] x y rotation side)
BOOT0  -  [Key_SMD_3x4x2]  9.27 46.47 90 top
C1  100nF  [C0603]  7.49 29.71 135 bottom
C3  100nF  [C0603]  5.21 45.59 90 bottom
C4  10uF  [C0603]  6.86 45.59 90 bottom
C5  10uF  [C0603]  12.57 36.06 45 bottom
C6  100nF  [C0603]  9.78 25.39 225 bottom
C7  100nF  [C0603]  13.97 40.89 180 top
C8  100nF  [C0603]  11.62 48.83 90 bottom
C9  100nF  [C0603]  15.37 48.38 180 bottom
C10  100nF  [C0603]  9.14 8.88 180 top
C11  100nF  [C0603]  15.37 46.6 180 bottom
C12  22pF  [C0603]  8.83 15.21 0 bottom
C13  22pF  [C0603]  12.45 15.23 180 bottom
C14  22pF  [C0603]  8.76 19.3 0 bottom
C15  22pF  [C0603]  12.83 19.3 180 bottom
C16  100nF  [C0603]  16.45 54.28 270 bottom
C17  100nF  [C0603]  14.48 28.82 135 bottom
C25  100nF  [CAP-TH_L5.5-W3.2-P5.00-D0.5]  15.75 -20.05 0 top
C26  100nF  [CAP-TH_L5.5-W3.2-P5.00-D0.5]  42.99 -20.05 0 top
C27  100nF  [CAP-TH_L5.5-W3.2-P5.00-D0.5]  28.01 -36.86 0 top
C28  100nF  [CAP-TH_L5.5-W3.2-P5.00-D0.5]  20.83 -36.86 0 top
C29  100nF  [CAP-TH_L5.5-W3.2-P5.00-D0.5]  62.79 -28.82 0 top
C31  100nF  [CAP-TH_L5.5-W3.2-P5.00-D0.5]  41.72 -8.05 0 top
C32  100nF  [CAP-TH_L5.5-W3.2-P5.00-D0.5]  6 -16.09 0 top
C33  100nF  [CAP-TH_L5.5-W3.2-P5.00-D0.5]  49.56 -34.32 0 top
C34  100nF  [CAP-TH_L5.5-W3.2-P5.00-D0.5]  80.24 -31.36 0 top
H1  PZ254V-11-04P  [HDR-TH_4P-P2.54-V-M]  11.05 54.22 0 top
H2  -  [HDR-TH_4P-P2.54-V-F]  11.18 51.17 180 top
H3  2.54-1*20P直针  [HDR-TH_20P-P2.54-V-M-1]  3.4 28.82 90 top
H4  2.54-1*20P直针  [HDR-TH_20P-P2.54-V-M-1]  18.6 28.82 270 top
PC13  -  [LED_0603]  10.54 39.74 0 top
PWR  -  [LED_0603]  6.35 12.31 270 top
R1  5.1K  [R0603]  12.78 3.68 270 bottom
R2  5.1K  [R0603]  9.78 3.68 270 bottom
R3  220  [R0603]  8.76 11.17 180 bottom
R4  220  [R0603]  8.76 12.95 180 bottom
R5  10K  [R0603]  15.37 35.93 45 bottom
R6  10K  [R0603]  10.04 42.67 180 top
R7  10K  [R0603]  13.97 42.67 0 top
R8  4.7K  [R0603]  10.54 38.09 180 top
R9  1K  [R0603]  6.35 9.39 270 top
R10  1M  [R0603]  0.7 -38.84 0 top
R12  16kΩ  [R0603]  35.11 -36.86 0 top
R14  13kΩ  [R0603]  44.26 -13.13 0 top
R16  2kΩ  [R0603]  68.09 -31.36 0 top
R17  20kΩ  [R0603]  71.52 -23.01 0 top
R18  160kΩ  [R0603]  74.94 -24.99 0 top
RESET  -  [Key_SMD_3x4x2]  13.21 46.35 270 top
U1  STM32F103C8T6  [LQFP-48_L7.0-W7.0-P0.50-LS9.0-BL]  11 30.52 45 top
U2  CH340N  [SOP-8_L4.9-W3.9-P1.27-LS6.0-BL]  11.13 12.06 90 top
U3  AMS1117-3.3  [SOT-223-3_L6.5-W3.4-P2.30-LS7.0-BR]  12.06 43.94 180 bottom
U15  OPA2350UAG4  [SOIC-8_L4.9-W3.9-P1.27-LS6.0-BL]  30.55 -11.86 0 top
U17  OPA2350UAG4  [SOIC-8_L4.9-W3.9-P1.27-LS6.0-BL]  56.35 -32.63 0 top
U18  32kΩ  [RES-TH_BD2.4-L6.3-P10.30-D0.6]  15.75 -27.55 0 top
U19  32kΩ  [RES-TH_BD2.4-L6.3-P10.30-D0.6]  42.99 -27.55 0 top
USB1  TYPE-C16PIN  [USB-C-SMD_TYPE-C16PIN]  11 3.8 0 top
X1  8MHz  [CRYSTAL-SMD_L5.0-W3.2]  10.67 17.52 180 top
X2  32.768kHz  [OSC-SMD_L3.2-W1.5]  10.79 21.46 180 top

## Footprints (pads in the part's own frame, mm; a bottom-side part is the same pattern mirrored in y, then rotated)
C0603
  rect 0.8x0.9 smd: 1(-0.7,0) 2(0.7,0)
CAP-TH_L5.5-W3.2-P5.00-D0.5
  round 1.6 hole 0.9: 1(-2.54,0) 2(2.54,0)
CRYSTAL-SMD_L5.0-W3.2
  rect 1.9x2.4 smd: 1(-2.05,0) 2(2.05,0)
HDR-TH_4P-P2.54-V-F
  rect 1.7x1.7 hole 1.1: 1(-3.81,0)
  round 1.7 hole 1.1: 2(-1.27,0) 3(1.27,0) 4(3.81,0)
HDR-TH_4P-P2.54-V-M
  rect 1.7x1.7 hole 1.1: 1(-3.81,0)
  round 1.7 hole 1.1: 2(-1.27,0) 3(1.27,0) 4(3.81,0)
HDR-TH_20P-P2.54-V-M-1
  rect 1.8x1.8 hole 1.2: 1(-24.13,0)
  round 1.8 hole 1.2: 2(-21.59,0) 3(-19.05,0) 4(-16.51,0) 5(-13.97,0) 6(-11.43,0) 7(-8.89,0) 8(-6.35,0) 9(-3.81,0) 10(-1.27,0) 11(1.27,0) 12(3.81,0) 13(6.35,0) 14(8.89,0) 15(11.43,0) 16(13.97,0) 17(16.51,0) 18(19.05,0) 19(21.59,0) 20(24.13,0)
Key_SMD_3x4x2
  rect 1.53x1.36 smd: 1(-2.035,0) 2(2.035,0)
LED_0603
  rect 0.8x0.8 smd: 1(-0.851,-0.01) 2(0.75,-0.005)
LQFP-48_L7.0-W7.0-P0.50-LS9.0-BL
  oval 0.27x1.5 smd: 1(-2.75,-4.25) 2(-2.25,-4.25) 3(-1.75,-4.25) 4(-1.25,-4.25) 5(-0.75,-4.25) 6(-0.25,-4.25) 7(0.25,-4.25) 8(0.75,-4.25) 9(1.25,-4.25) 10(1.75,-4.25) 11(2.25,-4.25) 12(2.75,-4.25) 25(2.75,4.25) 26(2.25,4.25) 27(1.75,4.25) 28(1.25,4.25) 29(0.75,4.25) 30(0.25,4.25) 31(-0.25,4.25) 32(-0.75,4.25) 33(-1.25,4.25) 34(-1.75,4.25) 35(-2.25,4.25) 36(-2.75,4.25)
  oval 1.5x0.27 smd: 13(4.25,-2.75) 14(4.25,-2.25) 15(4.25,-1.75) 16(4.25,-1.25) 17(4.25,-0.75) 18(4.25,-0.25) 19(4.25,0.25) 20(4.25,0.75) 21(4.25,1.25) 22(4.25,1.75) 23(4.25,2.25) 24(4.25,2.75) 37(-4.25,2.75) 38(-4.25,2.25) 39(-4.25,1.75) 40(-4.25,1.25) 41(-4.25,0.75) 42(-4.25,0.25) 43(-4.25,-0.25) 44(-4.25,-0.75) 45(-4.25,-1.25) 46(-4.25,-1.75) 47(-4.25,-2.25) 48(-4.25,-2.75)
OSC-SMD_L3.2-W1.5
  rect 1.05x1.7 smd: 1(-1.275,0) 2(1.275,0)
R0603
  rect 0.806x0.864 smd: 1(-0.753,0) 2(0.753,0)
RES-TH_BD2.4-L6.3-P10.30-D0.6
  round 1.524 hole 1: 1(-5.15,0) 2(5.15,0)
SOIC-8_L4.9-W3.9-P1.27-LS6.0-BL
  oval 0.588x2.045 smd: 1(-1.905,-2.772) 2(-0.635,-2.772) 3(0.635,-2.772) 4(1.905,-2.772) 5(1.905,2.772) 6(0.635,2.772) 7(-0.635,2.772) 8(-1.905,2.772)
SOP-8_L4.9-W3.9-P1.27-LS6.0-BL
  oval 0.63x1.865 smd: 1(-1.905,-2.683) 2(-0.635,-2.683) 3(0.635,-2.683) 4(1.905,-2.683) 5(1.905,2.683) 6(0.635,2.683) 7(-0.635,2.683) 8(-1.905,2.683)
SOT-223-3_L6.5-W3.4-P2.30-LS7.0-BR
  rect 2.5x1.1 smd: 1(2.97,-2.3) 2(2.97,0) 3(2.97,2.3)
  rect 2.34x3.6 smd: 4(-2.97,0)
USB-C-SMD_TYPE-C16PIN
  oval 1x2.1 hole 0.6x1.7: 1(-4.32,1.788) 2(4.32,1.788)
  oval 1x1.8 hole 0.6x1.4: 3(-4.32,-2.362) 4(4.32,-2.362)
  rect 0.6x1.15 smd: A1B12(-3.2,2.362) A4B9(-2.4,2.362) B1A12(3.2,2.362) B4A9(2.4,2.362)
  rect 0.3x1.15 smd: A5(-1.25,2.362) A6(-0.25,2.362) A7(0.25,2.362) A8(-1.75,2.362) B5(1.75,2.362) B6(0.75,2.362) B7(-0.75,2.362) B8(1.25,2.362)

## Nets
As in the schematic.

Pads without a net: U2 4; USB1 1 2 3 4 A8 B8

## Via types
v1: diameter 0.61, hole 0.305, Top Layer to Bottom Layer, 105 vias

## Routing (per net, layer and track width the routed paths; a pad name or vN(x,y) marks a point on that pad's centre or on a via; arc(x,y) is an arc through that point)
3V3: length 128.2
  Top Layer w0.254: v1(7.11,30.35) 7.11,30.52 U1.36 ; 9.14,24.76 9.94,25.55 U1.48 ; U1.24 12.9,36.31 arc(12.94,36.37) v1(12.95,36.44) ; 14.89,28.4 13.84,29.45 v1(13.84,29.46) 13.84,31.66 v1(12.6,32.91)
  Top Layer w0.508: U2.5 7.83,13.96 7.26,14.53 5.9,14.53 5.21,13.84 ; 3.3,4.69 4.95,6.34 4.95,8.25 5.65,8.95 v1(6.67,8.95) ; R9.2 6.36,8.64 v1(6.67,8.95) ; v1(6.67,8.95) 6.73,8.88 C10.2 U2.8 ; 18.6,48 17.45,48 16.68,48.76 v1(14.73,48.76) ; v1(16.51,53.59) 16.38,53.59 16.38,53.46 15.88,52.95 11.68,52.95 H2.3 arc(9.46,50.99) 9.27,50.54 BOOT0.2 ; R7.2 v1(17.15,42.67)
  Bottom Layer w0.254: C6.2 6.99,27.2 6.99,30.19 C1.2 ; v1(13.84,29.46) C17.2
  Bottom Layer w0.508: 18.6,48 18.16,48 arc(17.44,47.7) 17.15,46.98 v1(17.15,42.67) 17.15,40.38 arc(17,40.02) 16.64,39.87 13.97,39.87 arc(13.43,39.65) 13.21,39.11 13.21,36.57 ; C16.2 16.51,53.58 v1(16.51,53.59) 15.49,53.59 H1.4 ; C1.2 7,30.23 v1(7.11,30.35) 7.82,31.06 10.74,31.06 v1(12.6,32.91) 13.84,34.16 13.84,35.17 13.08,35.93 13.08,36.31 v1(12.95,36.44) 12.4,37 7.04,37 5.21,35.17 v1(5.21,13.82) 5.21,12.06 6.67,10.6 v1(6.67,8.95) ; H2.3 11.56,49.52 13.97,49.52 v1(14.73,48.76) 14.73,46.67 C11.2 14.67,44.3 U3.4 U3.2
  vias: v1(9.02,24.63)
+5V: length 95.1
  Top Layer w0.254: USB1.B4A9 v1(13.4,6.98) ; USB1.A4B9 v1(8.6,6.98)
  Bottom Layer w0.508: 5.7,7.23 8.35,7.23 arc(8.53,7.16) v1(8.6,6.98) ; 5.7,7.23 5.46,7.23 arc(5.1,7.38) 4.95,7.74 4.95,9.34 arc(4.83,9.65) 4.52,9.77 1.91,9.77 arc(1.33,10.01) 1.1,10.58 1.1,53.41 arc(1.48,54.34) 2.41,54.73 4.19,54.73 arc(4.91,54.43) 5.21,53.71 C3.2 ; 5.7,7.23 arc(5.71,7.23) 5.72,7.22 5.72,3.8 arc(5.94,3.26) 6.48,3.04 8.13,3.04 arc(8.4,2.93) 8.51,2.66 8.51,2.15 arc(8.69,1.7) 9.14,1.52 13.72,1.52 arc(14.17,1.7) 14.35,2.15 14.35,2.66 arc(14.46,2.93) 14.73,3.04 15.88,3.04 arc(16.23,3.19) 16.38,3.55 16.38,6.6 arc(16.2,7.05) 15.75,7.23 13.65,7.23 arc(13.47,7.16) v1(13.4,6.98) ; U3.3 5.37,46.23 ; 5.37,46.23 5.29,46.31 arc(5.32,46.26) 5.37,46.23
GND: length 67.7
  Top Layer w0.254: v1(12.44,38.79) 12.32,38.67 12.32,36.57 v1(11.94,36.19) ; RESET.1 13.21,46.09 arc(13.13,45.91) 12.95,45.84 v1(11.18,45.84) ; v1(10.27,26.93) 10.27,26.62 U1.47 8.92,25.27 8.79,25.27 8.03,24.5 8.03,19.76 7.14,18.87 7.14,16.16 v1(7.24,16.05) ; U1.23 13.1,35.81 13.21,35.81 14.54,37.14 v1(14.54,38.16) ; v1(8,29.71) 8,30.34 7.23,31.11 ; 7.23,31.11 U1.35 ; 7.23,31.11 7.24,31.11 ; v1(7.87,39.93) 9.49,39.93 arc(9.63,39.88) PC13.1 ; v1(12.32,12.69) 15.75,12.69 ; 14.54,28.05 15.16,27.42 v1(15.16,27.02)
  Bottom Layer w0.254: v1(11.18,45.84) 11.18,46.79 arc(11.14,46.88) 11.05,46.92 ; C6.1 v1(10.27,26.93) C1.1 8,29.23 v1(8,29.71) ; 8.1,15.23 8.1,14.88 arc(8.22,14.59) 8.51,14.47 12.38,14.47 arc(12.92,14.69) C13.1 arc(13.74,15.37) v1(14.21,15.77) arc(14.41,16.15) v1(14.48,16.56) v1(14.48,17.62) 14.48,18.66 arc(14.29,19.11) 13.84,19.3 C15.1 ; 8.1,15.23 7.62,15.23 arc(7.35,15.34) 7.24,15.61 v1(7.24,16.05) 7.24,19.04 arc(7.31,19.22) 7.49,19.3 C14.1 ; 8.1,15.23 arc(8.12,15.23) C12.1 ; v1(14.54,38.16) 14.83,37.86 R5.1 ; v1(21.08,28.82) 17.78,28.82 arc(17.33,28.64) 17.15,28.19 17.15,27.3 arc(17.06,27.1) 16.87,27.02 v1(15.16,27.02) 15.16,28.14 arc(15.11,28.27) C17.1
  vias: v1(2.98,2.09) v1(2.98,1.45) v1(3.62,2.09) v1(3.61,1.45) v1(7.37,15.36) v1(7.88,40.57) v1(8.25,0.63) v1(9.53,0.63) v1(10.16,41.65) v1(10.59,14.63) v1(10.85,13.05) v1(10.85,12.42) v1(11,0.61) v1(11.3,41.52) v1(11.49,13.05) v1(11.48,12.42) v1(11.81,42.98) v1(11.81,42.35) v1(12.45,0.63) v1(12.57,14.6) v1(13.54,14.84) v1(13.53,8.82) v1(13.53,8.18) v1(13.97,0.63) v1(14.16,8.82) v1(14.16,8.18) v1(14.54,38.79) v1(14.48,18.56) v1(15.18,38.79) v1(15.17,38.16) v1(15.56,8.82) v1(15.56,8.18) v1(15.75,40.82) v1(15.75,41.46) v1(16.07,11.49) v1(16.07,10.85) v1(16.19,8.82) v1(16.19,8.18) v1(16.57,14.41) v1(16.57,13.77) v1(16.7,11.49) v1(16.7,10.85) v1(17.02,1.9) v1(17.02,1.26) v1(17.21,14.41) v1(17.2,13.77) v1(17.65,1.26) v1(17.65,1.9) v1(19.62,1.83) v1(19.62,1.2) v1(20.26,1.83) v1(20.25,1.2) v1(21.08,29.46)
VBAT: length 27.1
  Top Layer w0.254: 18.6,4.82 19.94,6.16 19.94,21.08 19.79,21.23 v1(19.18,21.23) ; v1(12.57,24.12) 12.57,25.06 U1.1
  Bottom Layer w0.254: v1(12.57,24.12) 15.47,21.23 v1(19.18,21.23)
BOOT0: length 45.2
  Top Layer w0.254: v1(8.76,42.67) 9.28,42.67 R6.2 9.27,42.69 BOOT0.1 ; v1(4.44,18.28) 6.48,20.31 6.48,24.94 8.53,26.99
  Bottom Layer w0.254: v1(4.44,18.28) 4.06,18.66 2.54,18.66 1.78,19.42 1.78,41.27 2.03,41.52 4.19,41.52 5.33,42.67 v1(8.76,42.67)
BOOT1: length 3.8
  Top Layer w0.254: v1(16.26,36.57) 15.98,36.57 13.47,34.06
CH340_RXD: length 2.4
  Top Layer w0.254: U2.7 9.27,11.42 arc(9.72,11.24) v1(9.91,10.79)
  Bottom Layer w0.254: v1(9.91,10.79) 9.9,10.79 arc(9.63,10.9) R3.1
CH340_TXD: length 2.4
  Top Layer w0.254: 8.44,12.69 9.27,12.69 arc(9.72,12.88) v1(9.91,13.33)
  Bottom Layer w0.254: v1(9.91,13.33) 9.9,13.33 arc(9.63,13.22) R4.1
D+: length 9.3
  Top Layer w0.254: 10.75,6.42 USB1.A6 10.75,5.22 arc(10.83,5.03) 11.02,4.95 11.48,4.95 arc(11.67,5.03) 11.75,5.22 USB1.B6 11.75,9.68 arc(11.89,10.01) 12.22,10.15 13.81,10.15 arc(13.81,10.15) U2.1
D-: length 9.5
  Top Layer w0.254: 11.25,7.21 11.25,10.99 arc(11.38,11.3) 11.68,11.42 U2.2 ; 11.25,7.21 USB1.A7 ; 11.25,7.21 arc(11.24,7.23) 11.23,7.23 10.66,7.23 arc(10.37,7.11) 10.25,6.82 USB1.B7
NRST: length 29.1
  Top Layer w0.254: 18.6,45.46 17.45,44.31 RESET.2 13.22,44.3 R7.1 13.22,40.94 C7.2 13.27,40.82 v1(12.95,40.51) ; v1(10.41,36.06) 10.41,36.19 v1(8.51,38.09) ; U1.7 11.68,30.19 v1(11.68,33.9)
  Bottom Layer w0.254: v1(10.41,36.06) 11.68,34.79 v1(11.68,33.9) ; v1(8.51,38.09) 8.51,39.87 9.14,40.51 v1(12.95,40.51)
PA0: length 15.2
  Top Layer w0.254: U1.10 15.74,28.25 15.74,17.83 18.6,14.98
PA1: length 12.8
  Top Layer w0.254: U1.11 16.15,28.55 16.15,19.96 18.6,17.52
PA2: length 10.5
  Top Layer w0.254: 18.6,20.06 16.56,22.1 16.56,28.85 U1.12
PA3: length 10.5
  Top Layer w0.254: 18.6,22.6 16.99,24.21 16.99,29.01 15.49,30.51 15.49,31.13 U1.13
PA4: length 9.6
  Top Layer w0.254: 18.6,25.14 17.4,26.34 17.4,29.84 16.87,30.37 16.87,32.35 16.59,32.63 16.29,32.63 U1.14
PA5: length 10.5
  Top Layer w0.254: 15.22,32.29 16.32,33.39 17.02,33.39 17.27,33.14 17.27,32.12 18.03,31.36 19.18,31.36 19.88,30.66 19.88,28.83 H4.11
PA6: length 9.4
  Top Layer w0.254: 14.89,32.65 16.4,34.16 v1(16.76,34.16)
  Bottom Layer w0.254: v1(16.76,34.16) 17.02,33.9 19.18,33.9 19.78,33.3 19.78,31.4 18.6,30.22
PA7: length 6.1
  Top Layer w0.254: 14.54,33 16.33,34.79 17.27,34.79 18.6,33.46 18.6,32.76
PA8: length 10.9
  Top Layer w0.254: 8.53,34.06 7.26,35.32 7.26,35.66 5.21,37.71 5.21,40.89 3.3,42.79
PA9_TX: length 34.1
  Top Layer w0.254: 6.73,35.08 6.8,35.08 U1.30 ; 3.3,40.25 4.7,38.86 4.7,37.11 v1(6.73,35.08)
  Bottom Layer w0.152: R3.2 7.27,11.91 6.73,11.91 5.79,12.85 5.79,34.14 v1(6.73,35.08)
PA10_RX: length 32.4
  Top Layer w0.254: 3.3,37.71 3.3,37.67 v1(6.7,34.27) 6.9,34.27 U1.31
  Bottom Layer w0.152: R4.2 7.27,12.21 6.86,12.21 6.1,12.97 6.1,21.5 6.25,21.65 6.45,21.65 6.6,21.8 6.6,23.02 6.45,23.18 6.25,23.18 6.1,23.33 6.1,24.55 6.25,24.7 6.45,24.7 6.6,24.85 6.6,26.07 6.45,26.22 6.25,26.22 6.1,26.38 6.1,27.6 6.25,27.75 6.45,27.75 6.6,27.9 6.6,29.12 6.45,29.27 6.25,29.27 6.1,29.42 6.1,33.66 6.69,34.26 arc(6.7,34.26) v1(6.7,34.27)
PA11: length 5.1
  Top Layer w0.254: 3.3,35.17 4.83,33.65 6.82,33.65 7.46,33
PA12: length 4.2
  Top Layer w0.254: 7.11,32.65 6.62,33.14 3.81,33.14 3.3,32.63
PA15: length 4
  Top Layer w0.254: 3.4,30.22 3.43,30.22 5.21,28.44 5.74,28.44 U1.38
PB0: length 5.2
  Top Layer w0.254: U1.18 16.08,35.25 18.55,35.25 18.6,35.3
PB1: length 6.5
  Top Layer w0.254: U1.19 15.93,35.81 16.57,35.81 18.6,37.84
PB3: length 3.8
  Top Layer w0.254: U1.39 5.68,27.68 3.4,27.68
PB4: length 5.1
  Top Layer w0.254: 3.4,25.14 3.85,25.14 7.11,28.4
PB5: length 7.1
  Top Layer w0.254: 7.46,28.05 4.93,25.51 4.93,24.13 3.4,22.6
PB6_SCL: length 47.6
  Top Layer w0.254: v1(17.53,49.14) 17.15,49.52 17.15,51.81 16.65,52.3 13.58,52.3 H2.2 ; 9.78,29.65 10.41,30.28 v1(10.41,30.35) ; 9.78,29.65 U1.42 5.44,25.31 5.44,22.07 3.3,19.93 ; 9.78,29.65 9.78,29.65
  Bottom Layer w0.254: v1(17.53,49.14) 19.43,49.14 19.79,48.79 19.79,39.72 19.05,38.98 17.78,38.98 17.27,38.47 17.27,36.31 11.3,30.35 v1(10.41,30.35)
PB7_SDA: length 49.8
  Top Layer w0.254: v1(10.41,29.46) 10.29,29.46 U1.43 5.84,25.01 5.84,20.57 3.3,18.03 3.3,17.39
  Bottom Layer w0.254: v1(10.41,29.46) 11.09,29.46 18.07,36.44 19.18,36.44 20.19,37.46 20.19,39.14 20.45,39.39 20.57,39.39 20.83,39.65 20.83,40.67 20.57,40.92 20.45,40.92 20.19,41.17 20.19,42.19 20.45,42.44 20.57,42.44 20.83,42.7 20.83,43.71 20.57,43.97 20.45,43.97 20.19,44.22 20.19,45.24 20.45,45.49 20.57,45.49 20.83,45.75 20.83,46.76 20.57,47.02 20.45,47.02 20.19,47.27 20.19,48.28 20.45,48.54 20.57,48.54 20.83,48.79 20.83,49.81 20.57,50.06 20.45,50.06 20.19,50.32 20.19,50.67 19.27,51.59 15.4,51.59 H2.1
PB8: length 14.2
  Top Layer w0.254: 8.88,26.64 7.11,24.87 7.11,20 6.22,19.11 6.22,17.27 3.94,14.98 3.4,14.98
PB9: length 16.3
  Top Layer w0.254: 3.4,12.44 3.4,13.17 6.73,16.5 6.73,19.04 7.62,19.93 7.62,24.67 U1.46
PB10: length 8.2
  Top Layer w0.254: 13.12,34.41 18.6,39.89 18.6,40.38
PB11: length 10.6
  Top Layer w0.254: U1.22 16.64,38.64 16.64,40.96 18.6,42.92
PB12: length 20.2
  Top Layer w0.254: 3.3,52.95 7.11,49.14 7.11,38.3 U1.25
PB13: length 17.9
  Top Layer w0.254: 3.3,50.41 6.6,47.11 6.6,38.1 U1.26
PB14: length 15.6
  Top Layer w0.254: 3.3,47.87 6.12,45.05 6.12,38.01 8.07,36.05 8.07,35.93 U1.27
PB15: length 13.2
  Top Layer w0.254: 3.3,45.33 5.72,42.92 5.72,37.84 7.67,35.89 7.67,35.62 8.88,34.41
PC13: length 38.4
  Top Layer w0.254: R8.2 11,36.88 11,27.34 U1.2 13.2,25.14 13.21,25.14 v1(13.21,24.76)
  Bottom Layer w0.254: v1(13.21,24.76) 14.22,23.74 19.3,23.74 19.81,23.23 19.81,8.57 18.6,7.36
PC14: length 34.6
  Top Layer w0.254: U1.3 13.97,25.08 13.97,23.75 arc(13.86,23.47) 13.59,23.36 11.4,23.36 arc(10.87,23.14) 10.64,22.6 10.64,21.55 10.55,21.46 X2.2 v1(9.52,19.81)
  Bottom Layer w0.254: C14.2 9.52,19.3 v1(9.52,19.81) 9.27,20.06 7.37,20.06 6.48,19.17 6.48,14.72 7.24,13.96 13.72,13.96 15.24,12.44 15.24,10.53 15.88,9.9 18.6,9.9
PC15: length 25.4
  Top Layer w0.254: v1(12.13,20.69) 12.13,21.46 X2.1 11.14,21.46 11.05,21.55 11.05,22.6 arc(11.15,22.85) 11.4,22.95 14.07,22.95 arc(14.29,23.04) 14.38,23.26 14.38,25.38 13.12,26.64
  Bottom Layer w0.254: 18.6,12.44 16.64,12.44 15.75,13.33 15.75,19.42 14.48,20.69 v1(12.13,20.69) C15.2
PD0: length 18.2
  Top Layer w0.254: 13.47,26.99 14.86,25.6 14.86,20.8 arc(14.6,20.19) 13.99,19.93 11.28,19.93 arc(10.74,19.71) 10.52,19.17 10.52,17.61 10.43,17.52 X1.2 9.53,16.61 v1(9.53,15.61)
  Bottom Layer w0.254: C12.2 9.53,15.21 v1(9.53,15.61)
PD1: length 18.6
  Top Layer w0.254: U1.6 15.27,25.91 15.27,20.62 arc(15.23,20.33) 15.11,20.05 arc(14.94,19.85) 14.74,19.68 arc(14.47,19.57) 14.17,19.53 11.28,19.53 arc(11.03,19.42) 10.92,19.17 10.92,17.61 11.01,17.52 X1.1 11.81,16.61 v1(11.81,15.61)
  Bottom Layer w0.254: C13.2 11.81,15.3 v1(11.81,15.61)
SWCLK: length 37.2
  Top Layer w0.152: H1.2 8.64,55.36 2.79,55.36 2.16,54.73 2.16,31.87 2.54,31.49 5.21,31.49 6.48,30.22 6.48,29.89 U1.37
SWDIO: length 52
  Top Layer w0.152: 19.56,26.41 20.23,27.08 20.23,54.06 18.92,55.36 13.46,55.36 H1.3 ; U1.34 9.02,30.03 v1(9.02,29.97)
  Bottom Layer w0.152: 9.02,29.91 12.57,26.36 19.43,26.36
  vias: v1(19.43,26.41)
$1N712: length 2.8
  Top Layer w0.254: USB1.B5 v1(12.75,3.93)
  Bottom Layer w0.254: v1(12.75,3.93) 12.75,4.4 arc(12.76,4.42) R1.1
$1N738: length 2.8
  Top Layer w0.254: USB1.A5 v1(9.75,3.93)
  Bottom Layer w0.254: v1(9.75,3.93) 9.75,4.4 arc(9.76,4.42) R2.1
$1N2179: length 1.6
  Top Layer w0.254: PC13.2 11.29,39.73 R8.1
$1N2206: length 1.4
  Top Layer w0.254: PWR.2 6.34,10.15 arc(6.35,10.15) R9.1

## Copper pours and planes (outline as drawn; the poured copper is in the pictures)
GND on Top Layer: -0.76,56.76 22.86,56.76 22.86,-1.28 -0.76,-1.28
GND on Bottom Layer: -0.76,56.76 22.86,56.76 22.86,-1.28 -0.76,-1.28

Small or netless copper shapes (teardrops, artwork), in the pictures only: 141 on Top Layer, 70 on Bottom Layer

## Text on the board
Top Silkscreen Layer: G CLK / G 3 | 1 | 0 | DIO 3 / SCL SDA | PB12 | PA0 | 3V3 | GND | PB11 | PB10 | PB1 | PB0 | PA7 | PA6 | PA5 | PA4 | PA3 | PA2 | PA1 | RST | PB14 | PA10 | PB13 | PB15 | PA15 | PA12 | PA11 | PB4 | +5V | PB6 | PB7 | PA8 | PB8 | PB3 | PB5 | PA9 | PB9 | PC15 | PC14 | PC13 | VBAT
